# EAGLE design MIDIPak_v3 (EAGLE 7.7.0)
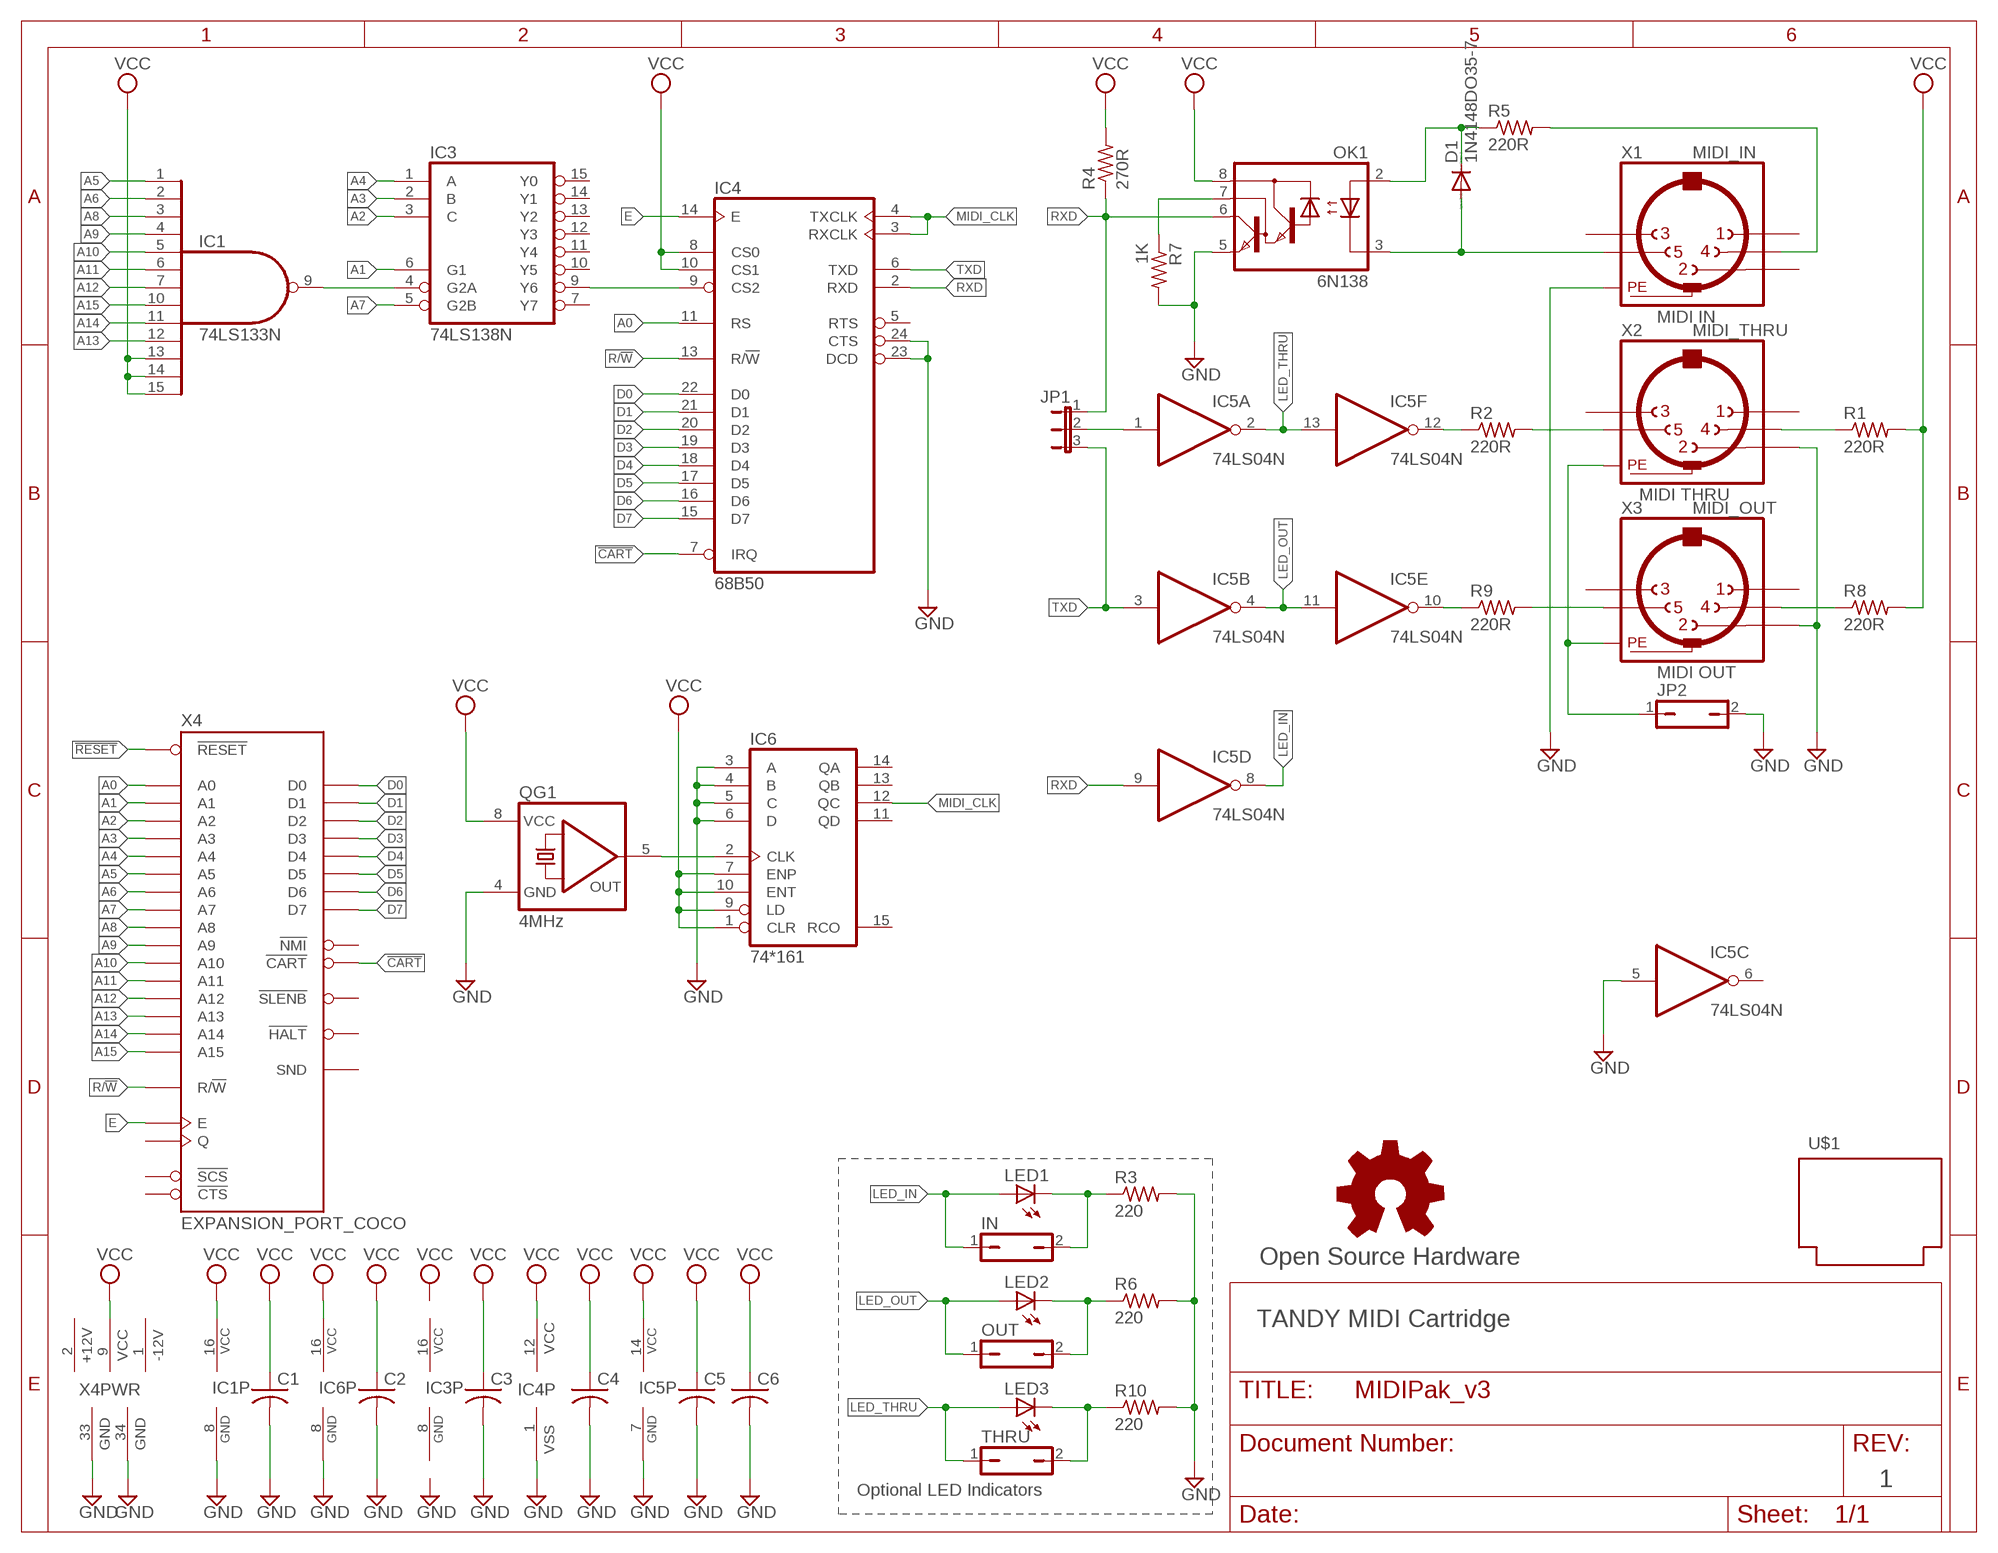
[diagram p0: schematic, sheet 1]

## Parts
C1  C-US025-025X050  [C025-025X050]
C2  C-US025-025X050  [C025-025X050]
C3  C-US025-025X050  [C025-025X050]
C4  C-US025-025X050  [C025-025X050]
C5  C-US025-025X050  [C025-025X050]
C6  C-US025-025X050  [C025-025X050]
D1  1N4148DO35-7  [DO35-7]
GOLD_ORB_SM1  Open Source Hardware  OSHWLOGOLOGO8MM  [OSHW_8MM]
IC1  74LS133N  74S133N  [DIL16-RP]
IC3  74LS138N  [DIL16-RP]
IC4  68B50  6850-RP  [DIL24-ROUNDPAD]
IC5  74LS04N  [DIL14-RP]
IC6  74*161  74160N  [DIL16-RP]
IN  JP1Q  [JP1]
JP1  JP2E  [JP2]
JP2  JP1Q  [JP1]
LED1  LED3MM  [LED3MM]
LED2  LED3MM  [LED3MM]
LED3  LED3MM  [LED3MM]
OK1  6N138  [DIL08]
OUT  JP1Q  [JP1]
QG1  4MHz  QG5460  [DIL08S]
R1  220R  R-US_0204/7  [0204/7]
R2  220R  R-US_0204/7  [0204/7]
R3  220  R-US_0204/7  [0204/7]
R4  270R  R-US_0204/7  [0204/7]
R5  220R  R-US_0204/7  [0204/7]
R6  220  R-US_0204/7  [0204/7]
R7  1K  R-US_0204/7  [0204/7]
R8  220R  R-US_0204/7  [0204/7]
R9  220R  R-US_0204/7  [0204/7]
R10  220  R-US_0204/7  [0204/7]
THRU  JP1Q  [JP1]
U$1  PROGRAM_PAK  [PROGRAM_PAK]
X1  MIDI_IN  MAB5SH  [MAB5SH]
X2  MIDI_THRU  MAB5SH  [MAB5SH]
X3  MIDI_OUT  MAB5SH  [MAB5SH]
X4  EXPANSION_PORT_COCO  [MA20-2]

## Nets
!CART: IC4.7(IRQ) X4.8(!CART)
!RESET: X4.5(!RESET)
A0: IC4.11(RS) X4.19(A0)
A1: IC3.6(G1) X4.20(A1)
A2: IC3.3(C) X4.21(A2)
A3: IC3.2(B) X4.22(A3)
A4: IC3.1(A) X4.23(A4)
A5: IC1.1(I0) X4.24(A5)
A6: IC1.2(I1) X4.25(A6)
A7: IC3.5(G2B) X4.26(A7)
A8: IC1.3(I2) X4.27(A8)
A9: IC1.4(I3) X4.28(A9)
A10: IC1.5(I4) X4.29(A10)
A11: IC1.6(I5) X4.30(A11)
A12: IC1.7(I6) X4.31(A12)
A13: IC1.12(I9) X4.37(A13)
A14: IC1.11(I8) X4.38(A14)
A15: IC1.10(I7) X4.39(A15)
D0: IC4.22(D0) X4.10(D0)
D1: IC4.21(D1) X4.11(D1)
D2: IC4.20(D2) X4.12(D2)
D3: IC4.19(D3) X4.13(D3)
D4: IC4.18(D4) X4.14(D4)
D5: IC4.17(D5) X4.15(D5)
D6: IC4.16(D6) X4.16(D6)
D7: IC4.15(D7) X4.17(D7)
E: IC4.14(E) X4.6(E)
GND: C1.2 C2.2 C3.2 C4.2 C5.2 C6.2 IC1.8(GND) IC4.1(VSS) IC4.23(DCD) IC4.24(CTS) IC5.5(C:I) IC5.7(P:GND) IC6.3(A) IC6.4(B) IC6.5(C) IC6.6(D) IC6.8(GND) JP2.2 OK1.5(GND) QG1.4(GND) R3.2 R6.2 R7.2 R10.2 X1.PE X1.PE@(PE) X2.2 X3.2 X4.33(GND) X4.34(GND)
LED_IN: IC5.8(D:O) IN.1 LED1.A
LED_OUT: IC5.4(B:O) IC5.11(E:I) LED2.A OUT.1
LED_THRU: IC5.2(A:O) IC5.13(F:I) LED3.A THRU.1
MIDI_CLK: IC4.3(RXCLK) IC4.4(TXCLK) IC6.12(QC)
N$1: R9.2 X3.5
N$2: JP2.1 X2.PE X2.PE@(PE) X3.PE X3.PE@(PE)
N$3: R8.1 X3.4
N$4: IC5.10(E:O) R9.1
N$5: IC3.9(Y6) IC4.9(CS2)
N$6: D1.C OK1.2(A) R5.1
N$7: R5.2 X1.4
N$8: D1.A OK1.3(C) X1.5
N$9: OK1.7(VB) R7.1
N$10: R2.2 X2.5
N$11: IC5.12(F:O) R2.1
N$12: IN.2 LED1.K(C) R3.1
N$13: R1.1 X2.4
N$14: IC1.9(O) IC3.4(G2A)
N$15: IC6.2(CLK) QG1.5(OUT)
N$16: IC5.1(A:I) JP1.2
N$17: LED2.K(C) OUT.2 R6.1
N$18: LED3.K(C) R10.1 THRU.2
R/!W: IC4.13(R/!W) X4.18(R/!W)
RXD: IC4.2(RXD) IC5.9(D:I) JP1.1 OK1.6(VO) R4.1
TXD: IC4.6(TXD) IC5.3(B:I) JP1.3
VCC: C1.1 C2.1 C3.1 C4.1 C5.1 C6.1 IC1.13(I10) IC1.14(I11) IC1.15(I12) IC1.16(VCC) IC4.8(CS0) IC4.10(CS1) IC4.12(VCC) IC5.14(P:VCC) IC6.1(CLR) IC6.7(ENP) IC6.9(LD) IC6.10(ENT) IC6.16(VCC) OK1.8(VCC) QG1.8(VCC) R1.2 R4.2 R8.2 X4.9(VCC)
Unconnected: IC3.7(Y7) IC3.10(Y5) IC3.11(Y4) IC3.12(Y3) IC3.13(Y2) IC3.14(Y1) IC3.15(Y0) IC4.5(RTS) IC5.6(C:O) IC6.11(QD) IC6.13(QB) IC6.14(QA) IC6.15(RCO) X1.1 X1.2 X1.3 X2.1 X2.3 X3.1 X3.3 X4.3(!HALT) X4.4(!NMI) X4.7(Q) X4.32(!CTS) X4.35(SND) X4.36(!SCS) X4.40(!SLENB)

## Notes on the sheet
- MIDI IN
- MIDI THRU
- MIDI OUT
- TANDY MIDI Cartridge
- 1
- Optional LED Indicators

## Power pins joined to a net without a drawn wire
+12V: X4.2(+12V)
-12V: X4.1(-12V)
GND: IC3.8(GND)
VCC: IC3.16(VCC)

## Library data of the parts
C1-C6 = rcl:C-US: CAPACITOR, American symbol
D1 = diode-jlb:1N4148: DIODE high speed (Philips)
GOLD_ORB_SM1 = oshw:OSHWLOGO: The OSHW logo for PCB layout
IC1 = 74xx-us-jlb:74*133: 13-input NAND gate
IC3 = 74xx-us-jlb:74*138: 3-line to 8-line DECODER/DEMULTIPLEXER
IC4 = micro-motorola:6850: MICROCONTROLLER/MEMORY DEVICE
IC5 = 74xx-us-jlb:74*04: Hex INVERTER
IC6 = 74xx-us-jlb:74*160: Synchronous 4-bit COUNTER
IN JP2 OUT THRU = jumper-jlb:JP1Q: JUMPER
JP1 = jumper-jlb:JP2E: JUMPER
LED1-LED3 = led:LED: LED OSRAM: - CHIPLED LG R971, LG N971, LY N971, LG Q971, LY Q971, LO R971, LY R971 LH N974, LH R974 LS Q976, LO Q976, LY Q976 LO Q996 - Hyper CHIPLED LW Q18S LB Q993, LB Q99A, LB R99A - SideLED LS A670, LO A670, LY A670, LG A670, LP A670 LB A673, LV A673, LT A673, LW A673 LH A674 LY A675 LS A676, LA A676, LO A676, LY A676, LW A676 LS A679, LY A679, LG A679 - Hyper Micro SIDELED® LS Y876, LA Y876, LO Y876, LY Y876 LT Y87S - SmartLED LW L88C, LW L88S LB L89C, LB L89S, LG L890 LS L89K, LO L89K, LY L89K LS L896, LA L896, LO L896, LY L896 - TOPLED LS T670, LO T670, LY T670, LG T670, LP T670 LSG T670, LSP T670, LSY T670, LOP T670, LYG T670 LG T671, LOG T671, LSG T671 LB T673, LV T673, LT T673, LW T673 LH T674 LS T676, LA T676, LO T676, LY T676, LB T676, LH T676, LSB T676, LW T676 LB T67C, LV T67C, LT T67C, LS T67K, LO T67K, LY T67K, LW E67C LS E67B, LA E67B, LO E67B, LY E67B, LB E67C, LV E67C, LT E67C LW T67C LS T679, LY T679, LG T679 LS T770, LO T770, LY T770, LG T770, LP T770 LB T773, LV T773, LT T773, LW T773 LH T774 LS E675, LA E675, LY E675, LS T675 LS T776, LA T776, LO T776, LY T776, LB T776 LHGB T686 LT T68C, LB T68C - Hyper Mini TOPLED® LB M676 - Mini TOPLED Santana® LG M470 LS M47K, LO M47K, LY M47K Source: http://www.osram.convergy.de LUXEON: - LUMILED® LXK2-PW12-R00, LXK2-PW12-S00, LXK2-PW14-U00, LXK2-PW14-V00 LXK2-PM12-R00, LXK2-PM12-S00, LXK2-PM14-U00 LXK2-PE12-Q00, LXK2-PE12-R00, LXK2-PE12-S00, LXK2-PE14-T00, LXK2-PE14-U00 LXK2-PB12-K00, LXK2-PB12-L00, LXK2-PB12-M00, LXK2-PB14-N00, LXK2-PB14-P00, LXK2-PB14-Q00 LXK2-PR12-L00, LXK2-PR12-M00, LXK2-PR14-Q00, LXK2-PR14-R00 LXK2-PD12-Q00, LXK2-PD12-R00, LXK2-PD12-S00 LXK2-PH12-R00, LXK2-PH12-S00 LXK2-PL12-P00, LXK2-PL12-Q00, LXK2-PL12-R00 Source: www.luxeon.com KINGBRIGHT: KA-3528ASYC Source: www.kingbright.com
OK1 = optocoupler-jlb:6N138: MOTOROLA OPTO COUPLER; MF: VISHAY/TELEFUNKEN; MPN: 6N138; OC_FARNELL: 9860150; OC_NEWARK: 35K5294
QG1 = crystal:QG5460: CRYSTAL RESONATOR; OC_FARNELL: unknown; OC_NEWARK: unknown
R1-R10 = resistor:R-US_: RESISTOR, American symbol
U$1 = coco:PROGRAM_PAK
X1-X3 = con-hirschmann:MAB5SH: Female CONNECTOR 5 pins 90 deg. with shield, horizontal (DIN 41524); OC_FARNELL: 809883; OC_NEWARK: unknown
X4 = coco:EXPANSION_PORT_COCO

## Board
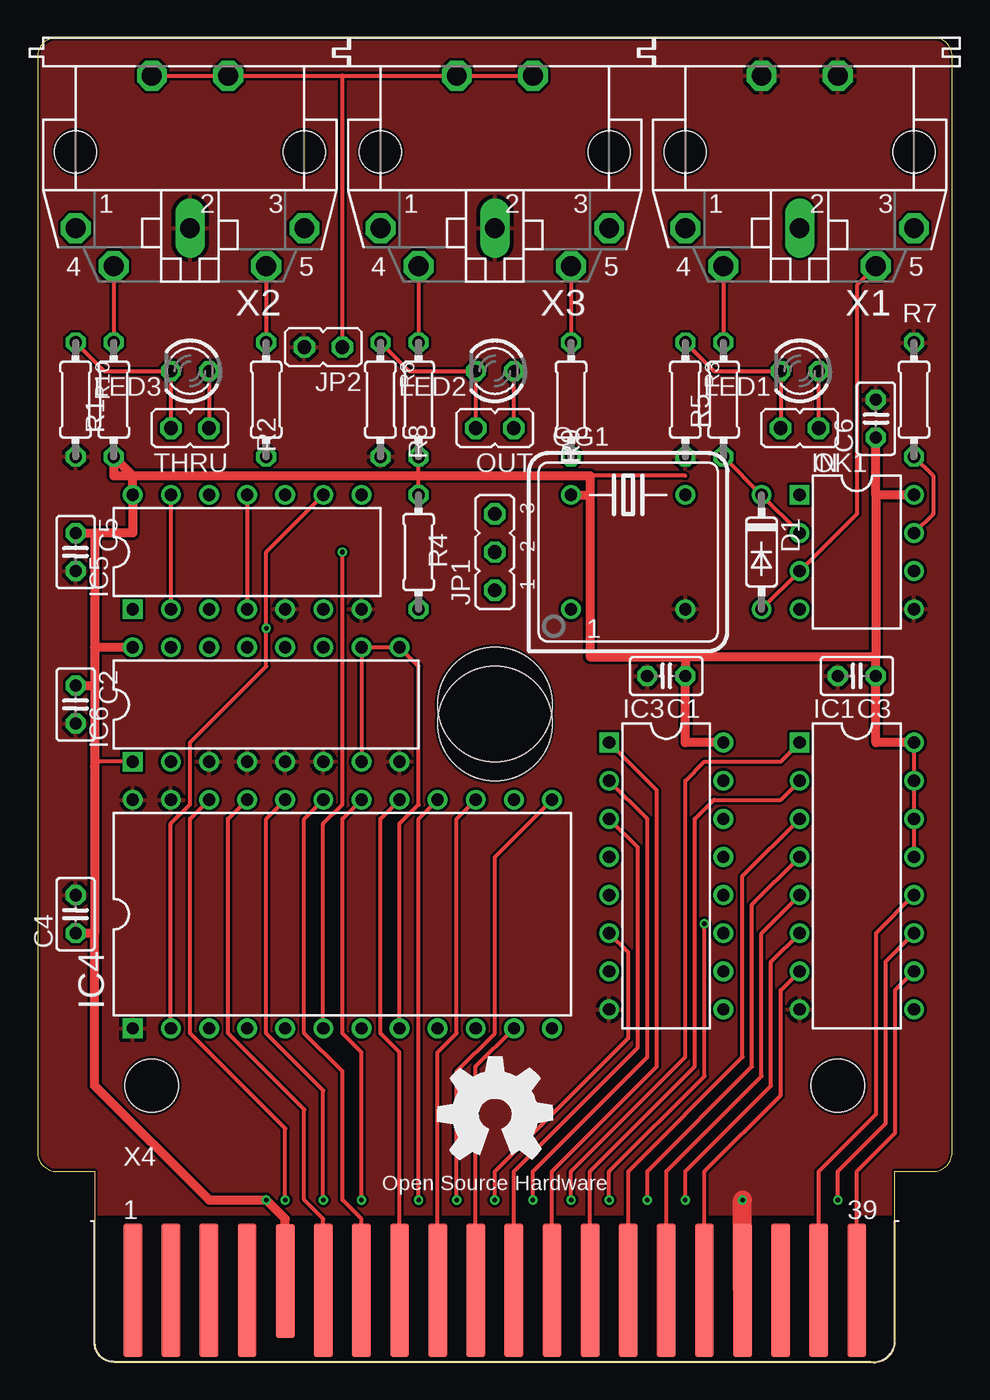
[diagram p1: board, top side]
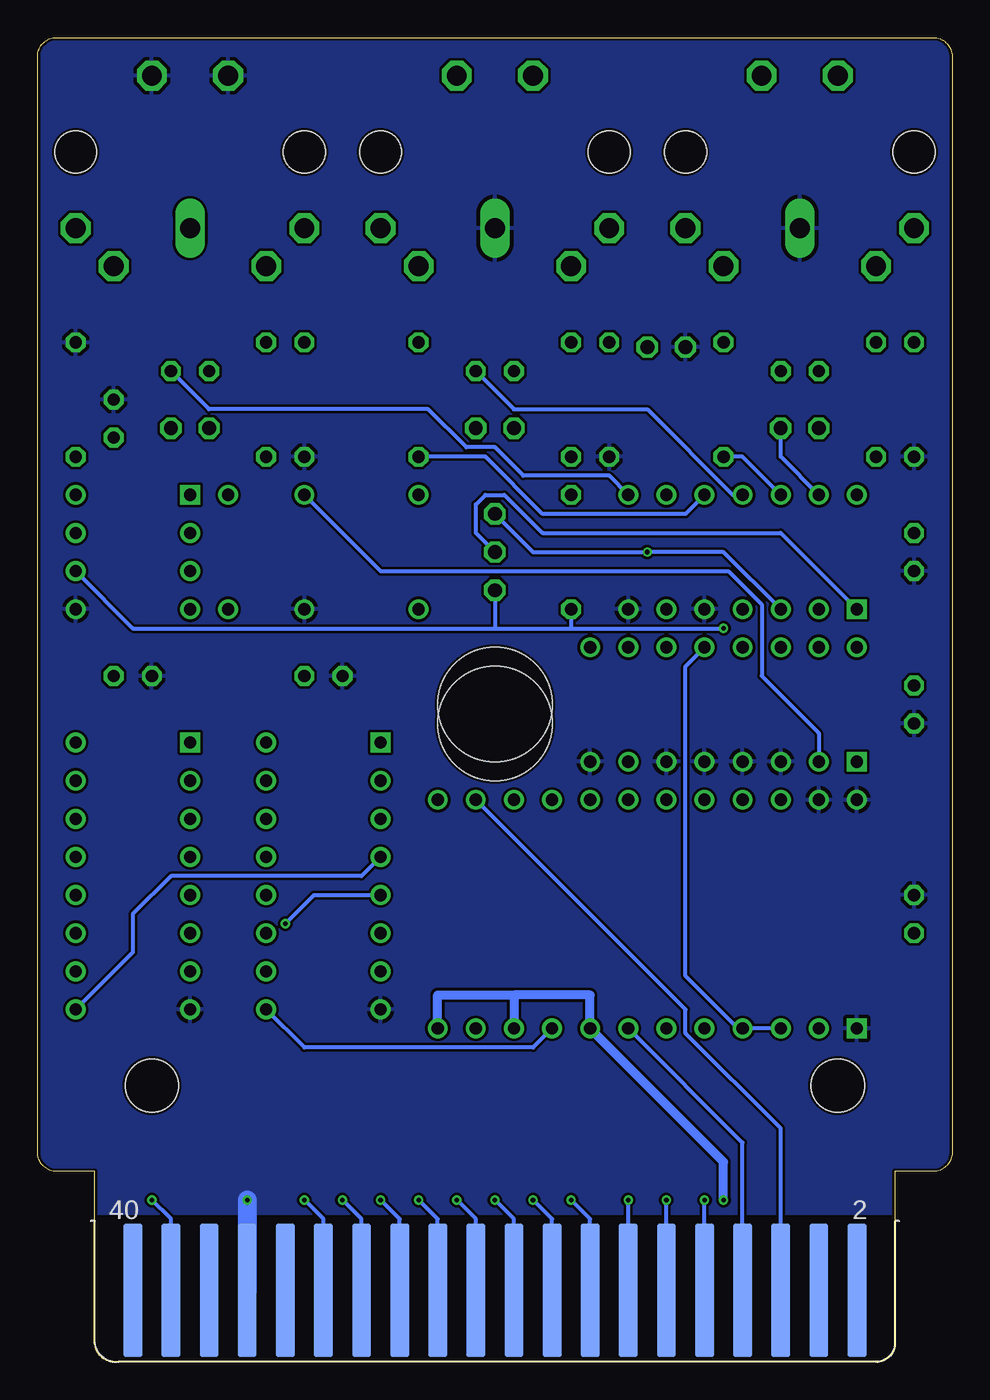
[diagram p2: board, bottom side, seen from below]

Size 60.97 x 88.27 mm. Coordinates in mm from the lower left corner, seen from the top.
Outline: 3.81,12.7 3.81,1.27 arc90 5.08,0 55.88,0 arc90 57.15,1.27 57.15,12.7 59.69,12.7 arc90 60.96,13.97 60.96,15.24 60.97,87 arc90 59.7,88.27 1.27,88.27 arc90 0,87 0,13.97 arc90 1.27,12.7 3.81,12.7
Copper layers (1*16): Top 0.035mm / dielectric 1.5mm / Bottom 0.035mm
Design rules "hackvana *": minimum track width 6mil, minimum drill 0.3mm, track to track 6mil, track to pad 6mil, pad to pad 6mil, via to via 6mil, smd to smd 0mil, copper to edge 6mil, drill to drill 6mil, minimum pad ring 10mil, minimum via ring 6mil, stop-mask expansion 2mil, vias tented up to drill 100mil, thermal gap 10mil

### Footprints (pad centres in the part's own frame; a part is rotated, then mirrored left to right if it is on the bottom)
C025-025X050 = drill 0.813 octagon: 1 -1.27,0; 2 1.27,0
DO35-7 = drill 0.813: A 3.81,0; C -3.81,0
DIL16-RP = drill 0.813 square: 1 -8.89,-3.81 | drill 0.813: 2 -6.35,-3.81; 3 -3.81,-3.81; 4 -1.27,-3.81; 5 1.27,-3.81; 6 3.81,-3.81; 7 6.35,-3.81; 8 8.89,-3.81; 9 8.89,3.81; 10 6.35,3.81; 11 3.81,3.81; 12 1.27,3.81; 13 -1.27,3.81; 14 -3.81,3.81; 15 -6.35,3.81; 16 -8.89,3.81
DIL24-ROUNDPAD = drill 0.813 square: 1 -13.97,-7.62 | drill 0.813: 2 -11.43,-7.62; 3 -8.89,-7.62; 4 -6.35,-7.62; 5 -3.81,-7.62; 6 -1.27,-7.62; 7 1.27,-7.62; 8 3.81,-7.62; 9 6.35,-7.62; 10 8.89,-7.62; 11 11.43,-7.62; 12 13.97,-7.62; 13 13.97,7.62; 14 11.43,7.62; 15 8.89,7.62; 16 6.35,7.62; 17 3.81,7.62; 18 1.27,7.62; 19 -1.27,7.62; 20 -3.81,7.62; 21 -6.35,7.62; 22 -8.89,7.62; 23 -11.43,7.62; 24 -13.97,7.62
DIL14-RP = drill 0.813 square: 1 -7.62,-3.81 | drill 0.813: 2 -5.08,-3.81; 3 -2.54,-3.81; 4 0,-3.81; 5 2.54,-3.81; 6 5.08,-3.81; 7 7.62,-3.81; 8 7.62,3.81; 9 5.08,3.81; 10 2.54,3.81; 11 0,3.81; 12 -2.54,3.81; 13 -5.08,3.81; 14 -7.62,3.81
JP1 = drill 0.914 octagon: 1 0,-1.27; 2 0,1.27
JP2 = drill 0.914 octagon: 1 -2.54,0; 2 0,0; 3 2.54,0
LED3MM = drill 0.813 octagon: A -1.27,0; K 1.27,0
DIL08 = drill 0.813 square: 1 -3.81,-3.81 | drill 0.813: 2 -1.27,-3.81; 3 1.27,-3.81; 4 3.81,-3.81; 5 3.81,3.81; 6 1.27,3.81; 7 -1.27,3.81; 8 -3.81,3.81
DIL08S = drill 0.813: 1 -3.81,-3.81; 4 3.81,-3.81; 5 3.81,3.81; 8 -3.81,3.81
0204/7 = drill 0.813 octagon: 1 -3.81,0; 2 3.81,0
PROGRAM_PAK = hole 7.62: 0,1.27; 0,0 | hole 3.556: -22.86,-24.13; 22.86,-24.13
MAB5SH = drill 1.321 octagon: 1 7.62,5.08; 3 -7.62,5.08; 4 5.08,7.62; 5 -5.08,7.62; PE -2.54,-5.08; PE@ 2.54,-5.08 | drill 1.321 long: 2 0,5.08 | hole 2.794: 7.62,0; -7.62,0
MA20-2 = smd 1.27 x 8.89: 1 -24.13,-0.305; 3 -21.59,-0.305; 5 -19.05,-0.305; 7 -16.51,-0.305; 11 -11.43,-0.305; 13 -8.89,-0.305; 15 -6.35,-0.305; 17 -3.81,-0.305; 19 -1.27,-0.305; 21 1.27,-0.305; 23 3.81,-0.305; 25 6.35,-0.305; 27 8.89,-0.305; 29 11.43,-0.305; 31 13.97,-0.305; 33 16.51,-0.305; 35 19.05,-0.305; 37 21.59,-0.305; 39 24.13,-0.305 | smd 1.27 x 8.89 bottom: 2 -24.13,-0.305; 4 -21.59,-0.305; 6 -19.05,-0.305; 8 -16.51,-0.305; 10 -13.97,-0.305; 12 -11.43,-0.305; 14 -8.89,-0.305; 16 -6.35,-0.305; 18 -3.81,-0.305; 20 -1.27,-0.305; 22 1.27,-0.305; 24 3.81,-0.305; 26 6.35,-0.305; 28 8.89,-0.305; 30 11.43,-0.305; 32 13.97,-0.305; 34 16.51,-0.305; 36 19.05,-0.305; 38 21.59,-0.305; 40 24.13,-0.305 | smd 1.27 x 7.62: 9 -13.97,0.305

### Placement (x,y rotation side)
C1  41.91,45.72 180 top
C2  2.54,43.81 270 top
C3  54.61,45.72 180 top
C4  2.54,29.84 90 top
C5  2.54,53.98 270 top
C6  55.88,62.87 90 top
D1  48.26,53.98 270 top
GOLD_ORB_SM1  30.48,16.51 0 top
IC1  54.61,32.38 270 top
IC3  41.91,32.38 270 top
IC4  20.32,29.84 0 top
IC5  13.97,53.98 0 top
IC6  15.24,43.81 0 top
IN  50.8,62.23 90 top
JP1  30.48,53.98 90 top
JP2  19.05,67.63 90 top
LED1  50.8,66.04 180 top
LED2  30.48,66.04 180 top
LED3  10.16,66.04 180 top
OK1  54.61,53.98 270 top
OUT  30.48,62.23 90 top
QG1  39.37,53.98 0 top
R1  5.08,64.14 270 top
R2  15.24,64.14 90 top
R3  43.18,64.14 270 top
R4  25.4,53.98 90 top
R5  45.72,64.14 90 top
R6  22.86,64.14 270 top
R7  58.42,64.14 90 top
R8  25.4,64.14 270 top
R9  35.56,64.14 90 top
R10  2.54,64.14 270 top
THRU  10.16,62.23 90 top
U$1  30.48,42.55 0 top
X1  50.8,80.64 180 top
X2  10.16,80.64 180 top
X3  30.48,80.64 180 top
X4  30.48,5.08 0 top

### Tracks (layer width: path | path; a pad name or v marks a point on that pad's centre or on a via)
!CART
  Bottom 0.254: X4.8 13.97,14.61 IC4.7
A0
  Top 0.254: X4.19 29.21,19.68 IC4.11
A1  (via drill 0.3)
  Top 0.254: v30.48,10.79 30.48,12.7 39.37,21.59 39.37,27.3 IC3.6
  Bottom 0.254: X4.20 29.21,9.53 v30.48,10.79
A2
  Top 0.254: X4.21 31.75,12.7 40.01,20.95 40.01,34.29 IC3.3
A3  (via drill 0.3)
  Top 0.254: v33.02,10.79 33.02,12.7 40.64,20.32 40.64,36.2 IC3.2
  Bottom 0.254: X4.22 31.75,9.53 v33.02,10.79
A4
  Top 0.254: X4.23 34.29,12.7 41.27,19.68 41.27,38.1 IC3.1
A5  (via drill 0.3)
  Top 0.254: v35.56,10.79 35.56,12.7 43.18,20.32 43.18,38.73 44.45,40.01 49.53,40.01 IC1.1
  Bottom 0.254: X4.24 34.29,9.53 v35.56,10.79
A6
  Top 0.254: X4.25 36.83,12.7 43.81,19.68 43.81,36.2 45.09,37.47 49.53,37.47 IC1.2
A7  (via drill 0.3)
  Top 0.254: v38.1,10.79 38.1,12.7 44.45,19.05 v44.45,29.21
  Bottom 0.254: X4.26 36.83,9.53 v38.1,10.79 | v44.45,29.21 42.55,31.11 IC3.5
A8
  Top 0.254: X4.27 39.37,12.7 46.99,20.32 46.99,32.38 IC1.3
A9  (via drill 0.3)
  Top 0.254: v40.64,10.79 40.64,12.7 47.62,19.68 47.62,30.48 IC1.4
  Bottom 0.254: X4.28 39.37,9.53 v40.64,10.79
A10
  Top 0.254: X4.29 41.91,12.7 48.26,19.05 48.26,28.57 IC1.5
A11  (via drill 0.3)
  Top 0.254: v43.18,10.79 43.18,12.7 48.89,18.41 48.89,26.67 IC1.6
  Bottom 0.254: X4.30 41.91,9.53 v43.18,10.79
A12
  Top 0.254: X4.31 44.45,12.7 49.53,17.78 49.53,24.77 IC1.7
A13
  Top 0.254: X4.37 52.07,12.7 55.88,16.51 55.88,28.57 IC1.12
A14  (via drill 0.3)
  Top 0.254: v53.34,10.79 53.34,12.7 56.52,15.88 56.52,26.67 IC1.11
  Bottom 0.254: X4.38 52.07,9.53 v53.34,10.79
A15
  Top 0.254: X4.39 54.61,12.7 57.15,15.24 57.15,24.77 IC1.10
D0  (via drill 0.3)
  Top 0.254: v16.51,10.79 16.51,15.56 10.16,21.91 10.16,36.2 IC4.22
  Bottom 0.254: X4.10 v16.51,10.79
D1
  Top 0.254: X4.11 19.05,9.53 17.78,10.79 17.78,16.83 12.7,21.91 12.7,36.2 IC4.21
D2  (via drill 0.3)
  Top 0.254: v19.05,10.79 19.05,18.1 15.24,21.91 15.24,36.2 IC4.20
  Bottom 0.254: X4.12 v19.05,10.79
D3
  Top 0.254: X4.13 21.59,9.53 20.32,10.79 20.32,19.37 17.78,21.91 17.78,36.2 IC4.19
D4  (via drill 0.3)
  Top 0.254: v21.59,10.79 21.59,20.64 20.32,21.91 20.32,36.2 IC4.18
  Bottom 0.254: X4.14 v21.59,10.79
D5
  Top 0.254: X4.15 24.13,20.64 22.86,21.91 22.86,36.2 IC4.17
D6  (via drill 0.3)
  Top 0.254: v25.4,10.79 25.4,36.2 IC4.16
  Bottom 0.254: X4.16 24.13,9.53 v25.4,10.79
D7
  Top 0.254: X4.17 26.67,20.64 27.94,21.91 27.94,36.2 IC4.15
E
  Bottom 0.254: X4.6 11.43,15.56 17.78,21.91 17.78,23.5 IC4.14
GND  (via drill 0.3)
  Top 1.27: X4.34 v46.99,10.79
  Bottom 1.27: v46.99,10.79 X4.34
  pour Top (isolate 0.178): 60.96,15.24 60.97,87 arc90 59.7,88.27 1.27,88.27 arc90 0,87 0,13.97 arc90 1.27,12.7 3.81,12.7 3.81,9.84 57.15,9.84 57.15,12.7 59.69,12.7 arc90 60.96,13.97
  pour Bottom (isolate 0.178): 0,87 0,13.97 arc90 1.27,12.7 3.81,12.7 3.81,9.84 57.15,9.84 57.15,12.7 59.69,12.7 arc90 60.96,13.97 60.96,15.24 60.97,87 arc90 59.7,88.27 1.27,88.27 arc90
LED_IN
  Top 0.254: IN.1 LED1.A
  Bottom 0.254: IC5.8 22.86,59.05 28.57,59.05 30.48,60.96 32.38,60.96 34.92,63.5 49.53,63.5 LED1.A
LED_OUT
  Top 0.254: IC5.11 IC5.4 | OUT.1 LED2.A
  Bottom 0.254: IC5.11 14.61,57.78 20.32,63.5 29.21,63.5 LED2.A
LED_THRU
  Top 0.254: IC5.13 IC5.2 | LED3.A THRU.1
  Bottom 0.254: IC5.13 11.43,60.33 THRU.1
MIDI_CLK
  Bottom 0.254: IC4.3 IC4.4 14.29,22.23 17.78,25.72 17.78,46.35 IC6.12
N$1
  Top 0.254: X3.5 R9.2
N$2
  Top 0.254: X2.PE@ X2.PE 20.32,85.72 | 20.32,85.72 X3.PE@ X3.PE | JP2.1 20.32,85.72
N$3
  Top 0.254: X3.4 R8.1
N$4
  Bottom 0.254: IC5.10 17.78,56.52 27.3,56.52 31.12,60.33 R9.1
N$5
  Bottom 0.254: IC4.9 27.94,20.95 43.18,20.95 IC3.9
N$6
  Top 0.254: OK1.2 D1.C R5.1
N$7
  Top 0.254: X1.4 R5.2
N$8
  Top 0.254: D1.A OK1.3 54.61,56.52 54.61,71.75 X1.5
N$9
  Top 0.254: R7.1 59.69,59.05 59.69,56.52 OK1.7
N$10
  Top 0.254: X2.5 R2.2
N$11
  Bottom 0.254: R2.1 13.97,60.33 IC5.12
N$12
  Top 0.254: R3.1 45.09,66.04 LED1.K IN.2
N$13
  Top 0.254: X2.4 R1.1
N$14
  Bottom 0.254: IC3.4 39.37,32.38 52.07,32.38 54.61,29.84 54.61,27.3 IC1.9
N$15
  Bottom 0.254: QG1.5 38.1,52.7 14.92,52.7 12.7,50.48 12.7,45.72 8.89,41.91 IC6.2
N$16
  Bottom 0.254: JP1.2 31.75,55.24 31.75,57.15 31.12,57.78 29.84,57.78 27.3,55.24 11.43,55.24 IC5.1
N$17
  Top 0.254: R6.1 24.77,66.04 LED2.K OUT.2
N$18
  Top 0.254: R10.1 4.45,66.04 LED3.K THRU.2
R/!W  (via drill 0.3)
  Top 0.254: v27.94,10.79 27.94,19.37 30.48,21.91 30.48,33.66 IC4.13
  Bottom 0.254: X4.18 26.67,9.53 v27.94,10.79
RXD  (via drill 0.3)
  Top 0.254: IC4.2 8.89,35.88 10.16,37.15 10.16,41.27 15.24,46.35 v15.24,48.9 15.24,53.98 IC5.9
  Bottom 0.254: 30.48,48.9 54.61,48.9 OK1.6 | 30.48,48.9 25.4,48.9 | 25.4,48.9 v15.24,48.9 | JP1.1 30.48,48.9 | R4.1 25.4,48.9
TXD  (via drill 0.3)
  Top 0.254: IC4.6 19.05,35.88 20.32,37.15 v20.32,53.98
  Bottom 0.254: IC5.3 15.24,53.98 v20.32,53.98 27.94,53.98 JP1.3
VCC  (via drill 0.3)
  Top 0.254: IC1.16 IC1.15 IC1.14 IC1.13 | 43.18,59.05 36.83,59.05 | IC6.7 IC6.10 IC6.9 25.4,46.35 25.4,37.15 24.13,35.88 IC4.8 | IC6.1 4.13,40.01 3.81,39.69 | R4.2 25.4,59.05 R8.2
  Top 0.61: X4.9 16.51,9.53 v15.24,10.79 11.43,10.79 3.81,18.41 3.81,28.57 | C2.1 3.81,45.09 | 3.81,45.09 3.81,39.69 3.81,28.57 | 3.81,28.57 C4.1 | C5.1 3.81,55.24 | 3.81,55.24 3.81,47.62 | 3.81,47.62 3.81,45.09 | 3.81,55.24 6.35,55.24 IC5.14 6.35,59.05 R1.2 5.08,59.05 22.86,59.05 25.4,59.05 36.83,59.05 36.83,57.78 | IC3.16 43.18,41.27 C1.1 43.18,46.99 | IC1.16 55.88,41.27 C3.1 55.88,46.99 | 55.88,46.99 43.18,46.99 | IC6.16 3.81,47.62 | QG1.8 36.83,57.78 | OK1.8 55.88,57.78 | 55.88,57.78 C6.1 | 55.88,57.78 55.88,46.99 | 36.83,57.78 36.83,46.99 43.18,46.99
  Bottom 0.61: v15.24,10.79 15.24,13.34 IC4.8 24.13,24.45 29.21,24.45 | 29.21,24.45 IC4.10 | IC4.12 34.29,24.45 29.21,24.45